# EAGLE design BandpassedGainAmpSMTMounthole (EAGLE 9.5.1)
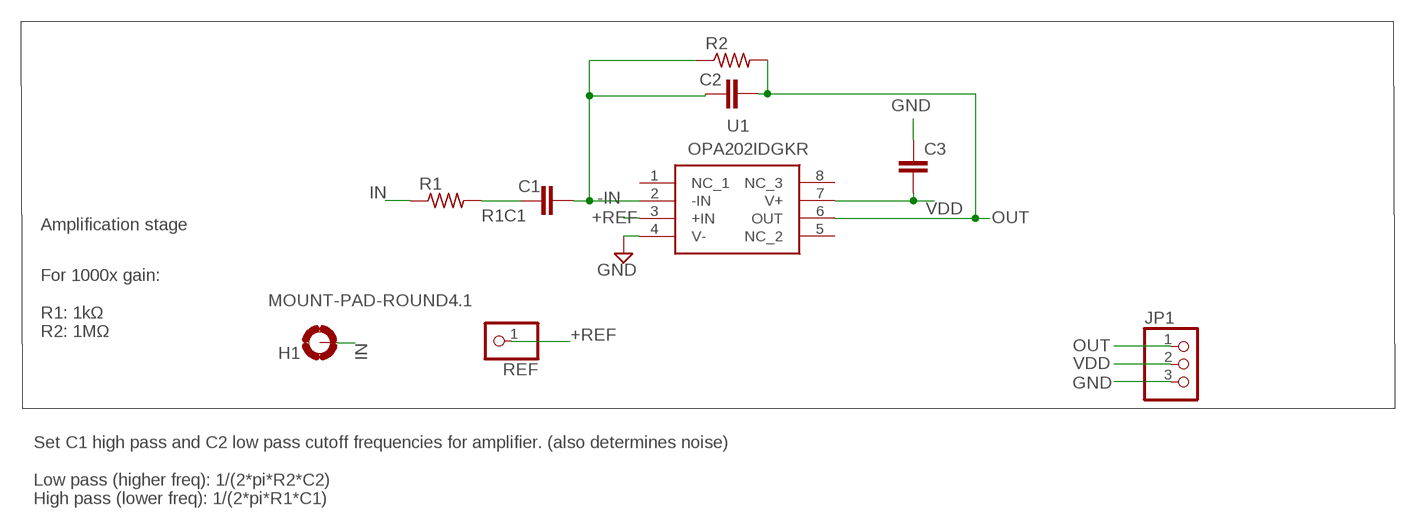
[diagram p0: schematic, sheet 1]

## Parts
C1  C-EUC0402  [C0402]
C2  C-EUC0402  [C0402]
C3  C-EUC0402  [C0402]
H1  MOUNT-PAD-ROUND4.1  [4,1-PAD]
JP1  PINHD-1X3  [1X03]
R1  R-US_R0402  [R0402]
R2  R-US_R0402  [R0402]
REF  PINHD-1X1  [1X01]
U1  OPA202IDGKR  [SOP65P490X110-8N]

## Nets
+REF: REF.1 U1.3(+IN)
-IN: C1.2 C2.1 R2.1 U1.2(-IN)
GND: C3.1 JP1.3 U1.4(V-)
IN: H1.B4,1(MOUNT) R1.1
OUT: C2.2 JP1.1 R2.2 U1.6(OUT)
R1C1: C1.1 R1.2
VDD: C3.2 JP1.2 U1.7(V+)
Unconnected: U1.1(NC_1) U1.5(NC_2) U1.8(NC_3)

## Notes on the sheet
- Amplification stage
- For 1000x gain:
  
  R1: 1kΩ
  R2: 1MΩ
- Set C1 high pass and C2 low pass cutoff frequencies for amplifier. (also determines noise)
  
  Low pass (higher freq): 1/(2*pi*R2*C2)
  High pass (lower freq): 1/(2*pi*R1*C1)

## Library data of the parts
C1-C3 = rcl:C-EU: CAPACITOR, European symbol; SPICEPREFIX: C
H1 = holes:MOUNT-PAD-ROUND: MOUNTING PAD, round
JP1 = pinhead:PINHD-1X3: PIN HEADER
R1 R2 = rcl:R-US_: RESISTOR, American symbol; SPICEPREFIX: R
REF = pinhead:PINHD-1X1: PIN HEADER
U1 = OPA202IDGKR:OPA202IDGKR: Precision Amplifiers Low noise (0.2- uVPP, 9-nV/ Hz), heavy capacitive drive (25-nF), super beta, precision op amp 8-VSSOP -40 to 105 Source: Datasheet <https://www.ti.com/lit/ds/symlink/opa202.pdf?ts=1636402854008&ref_url=https%3A%2F%2Fwww.ti.com%2Fproduct%2FOPA202>; DESCRIPTION: Precision Amplifiers Low noise (0.2- uVPP, 9-nV/ Hz), heavy capacitive drive (25-nF), super beta, precision op amp 8-VSSOP -40 to 105; HEIGHT: 1.1mm; MANUFACTURER_NAME: Texas Instruments; MANUFACTURER_PART_NUMBER: OPA202IDGKR; MOUSER_PART_NUMBER: 595-OPA202IDGKR; MOUSER_PRICE-STOCK: https://www.mouser.co.uk/ProductDetail/Texas-Instruments/OPA202IDGKR?qs=7MVldsJ5UaxKAkmdzK%2FGCA%3D%3D

## Board
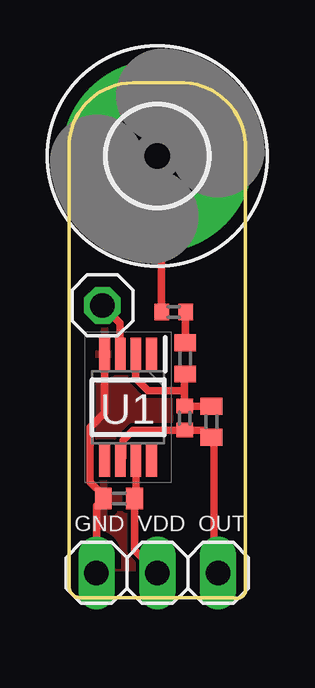
[diagram p1: board, top side]
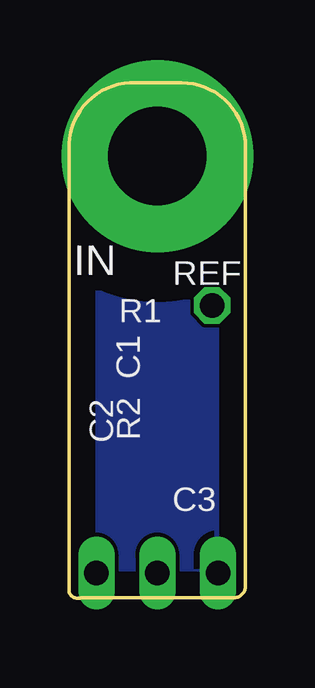
[diagram p2: board, bottom side, seen from below]

Size 7.37 x 21.48 mm. Coordinates in mm from the lower left corner, seen from the top.
Outline: 0.51,0.02 6.86,0.02 arc90 7.37,0.27 7.37,18.69 arc90 4.83,21.48 2.67,21.48 arc90 0,18.82 0,0.53 arc90 0.51,0.02
Copper layers (1*16): Top 0.035mm / dielectric 1.5mm / Bottom 0.035mm
Design rules "default": minimum track width 6mil, minimum drill 0.35mm, track to track 6mil, track to pad 6mil, pad to pad 6mil, via to via 6mil, smd to smd 6mil, copper to edge 40mil, drill to drill 6mil, minimum pad ring 10mil, minimum via ring 8mil, stop-mask expansion 4mil, vias tented up to drill 0mil, thermal gap 10mil

### Footprints (pad centres in the part's own frame; a part is rotated, then mirrored left to right if it is on the bottom)
C0402 = smd 0.7 x 0.9: 1 -0.65,0; 2 0.65,0
4,1-PAD = drill 4.1 pad 8: B4,1 0,0
1X03 = drill 1.016 long: 1 -2.54,0; 2 0,0; 3 2.54,0
R0402 = smd 0.6 x 0.7: 1 -0.5,0; 2 0.5,0
1X01 = drill 1.016 octagon: 1 0,0
SOP65P490X110-8N = smd 1.4 x 0.45: 1 -2.2,0.975; 2 -2.2,0.325; 3 -2.2,-0.325; 4 -2.2,-0.975; 5 2.2,-0.975; 6 2.2,-0.325; 7 2.2,0.325; 8 2.2,0.975

### Placement (x,y rotation side)
C1  4.85,10 270 top
C2  5.94,7.36 270 top
C3  2.08,4.16 0 top
H1  3.68,18.44 0 top
JP1  3.68,1.06 180 top
R1  4.37,11.93 0 top
R2  4.83,7.51 270 top
REF  1.4,12.21 0 top
U1  2.46,7.97 270 top

### Tracks (layer width: path | path; a pad name or v marks a point on that pad's centre or on a via)
+REF
  Top 0.305: U1.3 2.14,11.47 REF.1
-IN
  Top 0.152: U1.2
  Top 0.305: C1.2 4.83,9.33 4.83,8.66 | 4.83,8.66 R2.1 C2.1 | 4.83,8.66 3.3,8.66 2.78,9.18 U1.2
GND
  Top 0.152: 1.31,4.16 C3.1
  Top 0.305: U1.4 1.49,7.73 0.89,7.13 0.89,4.85 1.43,4.3 C3.1 1.14,3.87 JP1.3
  pour Top: -0.76,-0.49 8.38,-0.49 8.38,21.74 -0.76,21.74
  pour Bottom: -0.64,-0.87 -0.64,21.74 8.51,21.74 8.51,-0.87
IN
  Top 0.305: H1.B4,1 3.87,18.25 R1.1
OUT
  Top 0.305: U1.6 2.26,5.89 2.26,6.6 2.68,7.01 R2.2 5.64,7.01 C2.2 6.04,6.61 6.04,1.24 JP1.1
R1C1
  Top 0.305: R1.2 4.85,11.92 C1.1
VDD
  Top 0.305: U1.7 2.79,4.22 C3.2 2.73,2.01 JP1.2

### Text on the board
tNames: GND VDD OUT
bNames: IN